# EAGLE design ASL2112 (EAGLE 6.3)
DATABASE: ./../../../../../Components/TinyCircuits_Part_Database.txt
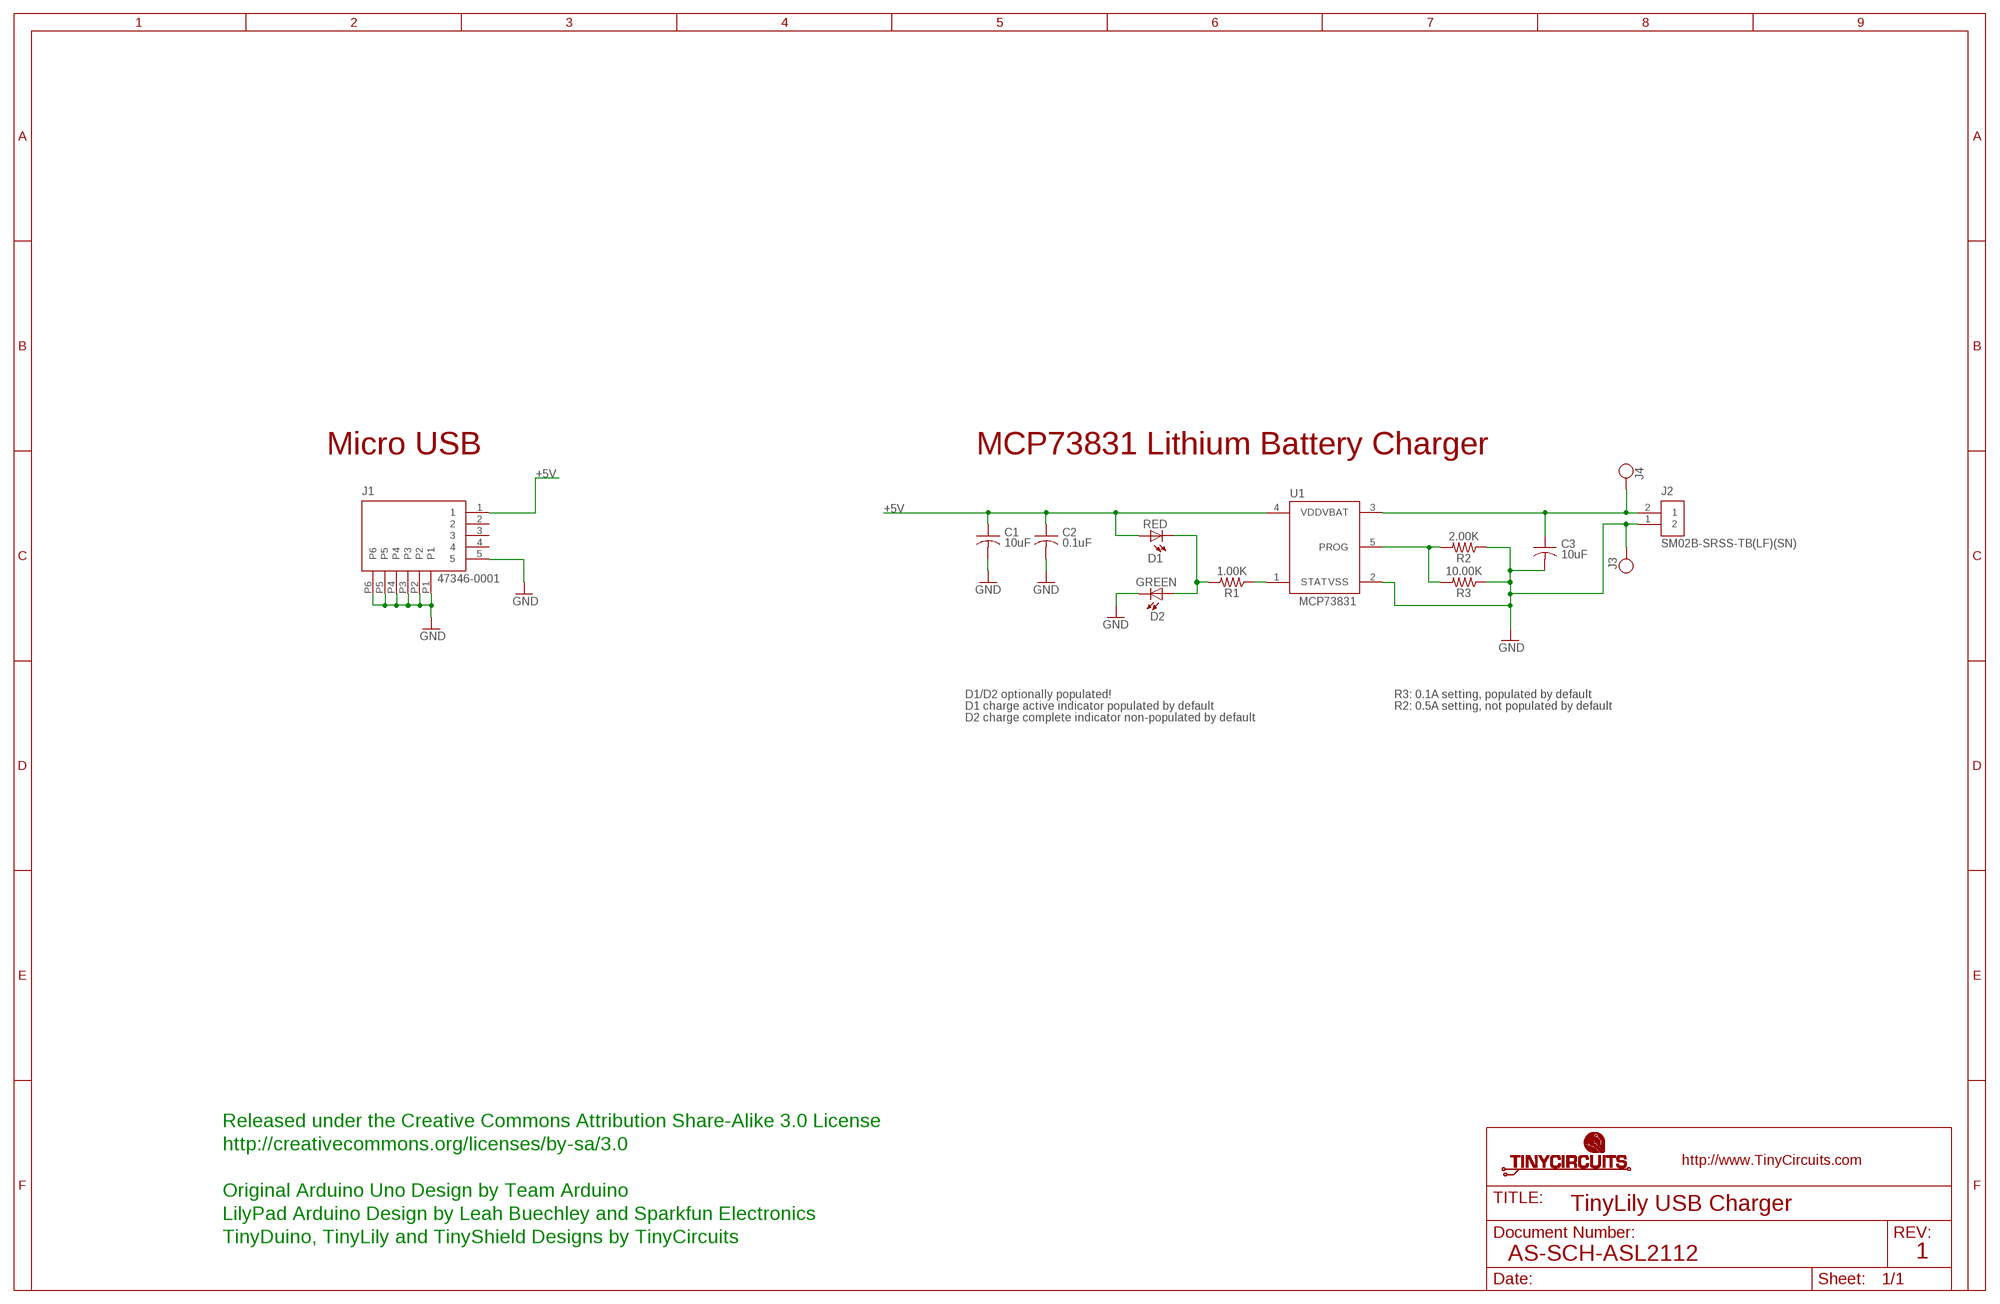
[diagram p0: schematic, sheet 1]

## Parts
C1  10uF  AS-ITM-00002  [C0603]
C2  0.1uF  AS-ITM-00008  [C0402]
C3  10uF  AS-ITM-00002  [C0603]
D1  RED  AS-ITM-00057  [0402_LED]
D2  GREEN  AS-ITM-00038  [0402_LED]
J1  47346-0001  AS-ITM-00021  [MICRO_USB]
J2  SM02B-SRSS-TB(LF)(SN)  AS-ITM-00231  [JST_SH_2X1]
J3  PIN_1X.1"1  [1X.1"_2]
J4  PIN_1X.1"1  [1X.1"_2]
R1  1.00K  AS-ITM-00003  [0402]
R2  2.00K  AS-ITM-00003  [0402]
R3  10.00K  AS-ITM-00032  [0402]
U1  MCP73831  AS-ITM-00136  [SOT-23]

## Nets
+5V: C1.1 C2.1 D1.1(A) J1.1 U1.4(VDD)
GND: C1.2 C2.2 C3.2 D2.2(C) J1.5 J1.P1 J1.P2 J1.P3 J1.P4 J1.P5 J1.P6 J2.1 J3.1 R2.1 R3.1 U1.2(VSS)
N$1: R1.1 U1.1(STAT)
N$2: D1.2(C) D2.1(A) R1.2
N$3: R2.2 R3.2 U1.5(PROG)
N$5: C3.1 J2.2 J4.1 U1.3(VBAT)
Unconnected: J1.2 J1.3 J1.4

## Notes on the sheet
- Micro USB | MCP73831 Lithium Battery Charger
- D1/D2 optionally populated! | R3: 0.1A setting, populated by default
- D1 charge active indicator populated by default | R2: 0.5A setting, not populated by default
- D2 charge complete indicator non-populated by default
- Released under the Creative Commons Attribution Share-Alike 3.0 License
- http://creativecommons.org/licenses/by-sa/3.0
- Original Arduino Uno Design by Team Arduino
- TinyLily USB Charger
- LilyPad Arduino Design by Leah Buechley and Sparkfun Electronics
- TinyDuino, TinyLily and TinyShield Designs by TinyCircuits
- AS-SCH-ASL2112 | 1

## Library data of the parts
C1 C3 = tinycircuits:AS-ITM-00002: CAP CER 10UF 10V 20% X5R 0603; PARTNO: AS-ITM-00002
C2 = tinycircuits:AS-ITM-00008: CAP CER 0.1UF 16V 10% X5R 0402; PARTNO: AS-ITM-00008
D1 = tinycircuits:AS-ITM-00057: LED 0402 RED WTR CLR SMD; PARTNO: AS-ITM-00057
D2 = tinycircuits:AS-ITM-00038: LED 0402 GREEN WTR CLR SMD; PARTNO: AS-ITM-00038
J1 = tinycircuits:AS-ITM-00021: CONN RCPT 5POS MICRO USB R/A; PARTNO: AS-ITM-00021
J2 = tinycircuits:AS-ITM-00231: CONN HEADER SH 2POS SIDE 1MM; PARTNO: AS-ITM-00231
J3 J4 = tinycircuits:PIN_1X.1": 1 Pin 0.100" Header
R1 = tinycircuits:AS-ITM-00003: RES 1.00K OHM 1/16W 1% 0402; PARTNO: AS-ITM-00003
R2 = tinycircuits:AS-ITM-00003: RES 1.00K OHM 1/16W 1% 0402; PARTNO: AS-ITM-00003; VALUE: 1.00K
R3 = tinycircuits:AS-ITM-00032: RES 10.0K OHM 1/16W 1% 0402 SMD; PARTNO: AS-ITM-00032; VALUE: 10.0K
U1 = tinycircuits:AS-ITM-00136: IC CONTROLLER LI-ION 4.2V SOT23-5; PARTNO: AS-ITM-00136

## Net classes
2 gnd: width 0.305 mm, drill 0.559 mm, clearance 0.254 mm

## Board
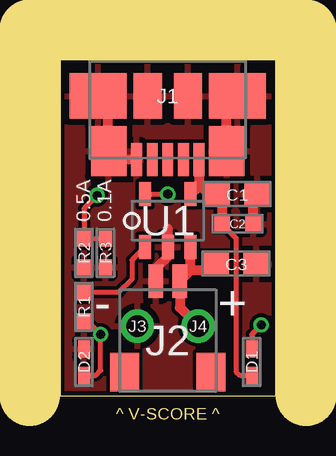
[diagram p1: board, top side]
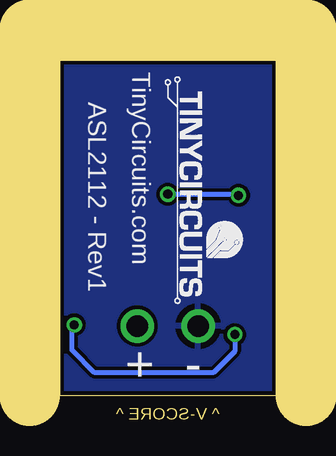
[diagram p2: board, bottom side, seen from below]

Size 9 x 14 mm. Coordinates in mm from the lower left corner, seen from the top.
Outline: 0,0 9,0 9,14 0,14 0,0
Copper layers (1*16): Top 0.035mm / dielectric 1.5mm / Bottom 0.035mm
Design rules "default *": minimum track width 8mil, minimum drill 15mil, track to track 6mil, track to pad 6mil, pad to pad 6mil, via to via 6mil, smd to smd 6mil, copper to edge 6mil, drill to drill 8mil, minimum pad ring 8mil, minimum via ring 5mil, stop-mask expansion 4mil, vias tented up to drill 25mil, thermal gap 10mil
tRestrict: 1 lines
bRestrict: 1 lines
Milling: 5 lines

### Footprints (pad centres in the part's own frame; a part is rotated, then mirrored left to right if it is on the bottom)
C0603 = smd 1.1 x 1: 1 -0.85,0; 2 0.85,0
C0402 = smd 0.65 x 0.6: 1 -0.65,0; 2 0.65,0
0402_LED = smd 0.7 x 0.5: 1 -0.55,0; 2 0.55,0
MICRO_USB = smd 1.38 x 0.45: 1 2.66,1.3; 2 2.66,0.65; 3 2.66,0; 4 2.66,-0.65; 5 2.66,-1.3 | smd 2.1 x 1.475: P1 2.3,-2.462; P2 2.3,2.462 | smd 1.9 x 2.375: P3 0,2.913; P4 0,-2.913 | smd 1.9 x 1.175: P5 0,0.838; P6 0,-0.838
JST_SH_2X1 = smd 0.6 x 1.4: 1 -0.5,2.475; 2 0.5,2.475 | smd 1.2 x 1.6: PAD1 -1.8,-1.325; PAD2 1.8,-1.325
1X.1"_2 = drill 0.889 pad 1.397: 1 0,0
0402 = smd 0.65 x 0.55: 1 -0.6,0; 2 0.6,0
SOT-23 = smd 0.5 x 1: 1 -0.95,-1.1; 2 0,-1.1; 3 0.95,-1.1; 4 0.95,1.1; 5 -0.95,1.1

### Placement (x,y rotation side)
C1  7.39,8.4 0 top
C2  7.41,7.16 0 top
C3  7.35,5.5 0 top
D1  8,1.4 90 top
D2  1,1.4 90 top
J1  4.5,12.5 270 top
J2  4.5,2.3 0 top
J3  3.23,2.9 0 top
J4  5.77,2.9 0 top
R1  1,3.7 270 top
R2  1,5.95 90 top
R3  1.9,5.95 90 top
U1  4.5,7.3 0 top
U$1  [DOCFIELD-TINYCIRCUITS-PCB]  28.5,-11 0 top  (outside the outline)

### Tracks (layer width: path | path; a pad name or v marks a point on that pad's centre or on a via)
+5V
  Top 0.203: C2.1 7.35,6.57 7.35,1 7.5,0.85 D1.1
  Top 0.406: J1.1 5.8,8.8 | 5.8,8.8 5.8,8.75 U1.4 | 5.8,8.8 6.2,8.4 C1.1 6.76,8.17 C2.1
GND
  Top 0.203: 2,11.6 1.59,12.01 J1.P4 | 6.95,11.6 7.41,12.06 J1.P3 | 6.95,11.2 6.96,11.19 J1.P2
  Top 0.406: J1.5 2.4,9.84 J1.P1 | C2.2 8.06,8.22 C1.2 | J2.1 4,5.3 4.5,5.8 U1.2 | 4.5,6.55 4.5,6.95 | 6.95,11.2 6.95,11.6 | 2,11.2 2,11.6
  pour Bottom: 0,14 9,14 9,0 0,0
  pour Top: 0,14 9,14 9,0 0,0
N$1
  Top 0.203: U1.1 3,5.65 3,4.85 2.45,4.3 R1.1
N$2  (via drill 0.38)
  Top 0.203: D2.1 1.5,0.85 1.7,1.05 v1.7,2.55 1.15,3.1 R1.2 | v8.4,2.95 8,2.55 D1.2
  Bottom 0.203: v1.7,2.55 1.7,1.85 2.6,0.95 7.55,0.95 8.5,1.9 8.5,2.85 v8.4,2.95
N$3  (via drill 0.38)
  Top 0.203: U1.5 v4.5,8.4 | v1.55,8.35 1,7.8 R2.2 R3.2
  Bottom 0.203: v4.5,8.4 1.6,8.4 v1.55,8.35
N$5
  Top 0.406: 5.45,5.23 J2.2 5,3.67 J4.1 | 5.45,5.23 U1.3 | C3.1 6.23,5.23 5.45,5.23

### Text on the board
Dimension: ^ V-SCORE ^
tPlace: 0.5A | 0.1A | - | +
bPlace: TinyCircuits.com | ASL2112 - Rev1 | - | +
Document: FABRICATION DRAWING | NOTES: | 1. PRINTED CIRCUIT BOARD MADE FROM NEMA GRADE FR-4 EPOXY LAMINATE | WITH 1 OUNCE COPPER PLATING AND .024 THICKNESS. | 2. ALL DIMENSIONS ARE GIVEN IN INCHES. | 3. CIRCUIT PATHS ARE FOR REFERENCE ONLY. | 4. HOLE SIZES SHOWN ARE FINISHED DIAMETERS AFTER PLATING. | 5. BOARD PLATED USING REFLOW OR SIMILAR METHOD. | 6. BOARD TO HAVE BLUE SOLDER MASK ON PLATED SURFACES USING WET FILM | 7. SILKSCREEN BOARD USING WHITE INK. | SR100 OR SR1010 EPOXY. EQUIVALENT WET OR DRY FILM MAY BE USED. | 8. THE FOLLOWING INFORMATION APPLIES TO THIS BOARD: | * 2 COPPER LAYERS | * .024 BOARD THICKNESS | * REQUIRES TOP SIDE SILKSCREEN | Released under the Creative Commons Attribution Share-Alike 3.0 License | http://creativecommons.org/licenses/by-sa/3.0 | Original Arduino Uno Design by Team Arduino | LilyPad Arduino Design by Leah Buechley and Sparkfun Electronics | TinyDuino, TinyLily and TinyShield Designs by TinyCircuits | TinyLily USB Charger | AS-PCB-ASL2112 | 1